# EAGLE design rev1 (EAGLE 6.4)
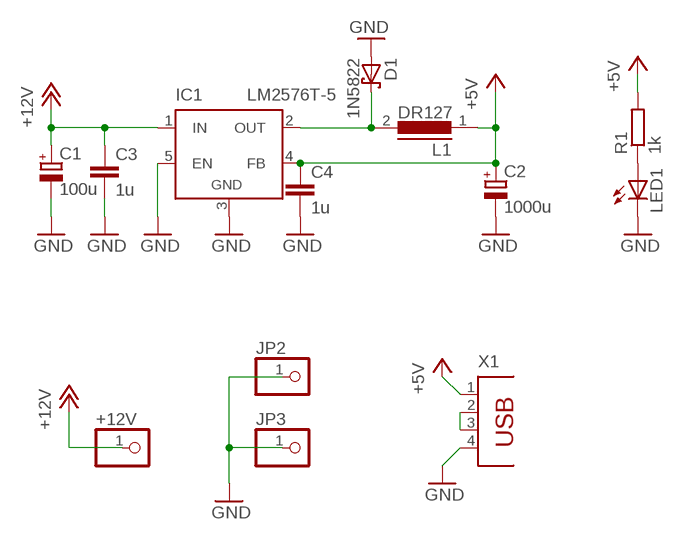
[diagram p0: schematic, sheet 1]

## Parts
+12V  PINHD-1X1  [1X01]
C1  100u  CPOL-EUTT2D6L  [TT2D6L]
C2  1000u  CPOL-EUTT5D9L  [TT5D9L]
C3  1u  C-EUC0805K  [C0805K]
C4  1u  C-EUC0805K  [C0805K]
D1  1N5822  [DO201_5]
IC1  LM2576T-5  LM2596TV  [TO220-51]
JP2  PINHD-1X1  [1X01]
JP3  PINHD-1X1  [1X01]
L1  DR127  [DR127]
LED1  LED3MM  [LED3MM]
R1  1k  R-EU_R0805  [R0805]
X1  PN87520  [PN87520]

## Nets
+5V: C2.+ C4.1 IC1.4(FB) L1.1 R1.2 X1.1
+12V: +12V.1 C1.+ C3.1 IC1.1(IN)
GND: C1.- C2.- C3.2 C4.2 D1.P$2(A) IC1.3(GND) IC1.5(EN) JP2.1 JP3.1 LED1.K(C) X1.4
N$1: LED1.A R1.1
N$2: D1.P$1(C) IC1.2(OUT) L1.2
N$3: X1.2 X1.3

## Library data of the parts
+12V JP2 JP3 = pinhead:PINHD-1X1: PIN HEADER
C1 C2 = rcl:CPOL-EU: POLARIZED CAPACITOR, European symbol
C3 C4 = rcl:C-EU: CAPACITOR, European symbol
D1 = _my_lib:1N5822
IC1 = linear:LM2596T: STEP-DOWN VOLTAGE REGULATOR
L1 = inductors:DR127: High Power Density, High Efficiency, Shielded Inductors Source: coiltronics_dr_series.pdf
LED1 = led:LED: LED OSRAM: - CHIPLED LG R971, LG N971, LY N971, LG Q971, LY Q971, LO R971, LY R971 LH N974, LH R974 LS Q976, LO Q976, LY Q976 LO Q996 - Hyper CHIPLED LW Q18S LB Q993, LB Q99A, LB R99A - SideLED LS A670, LO A670, LY A670, LG A670, LP A670 LB A673, LV A673, LT A673, LW A673 LH A674 LY A675 LS A676, LA A676, LO A676, LY A676, LW A676 LS A679, LY A679, LG A679 - Hyper Micro SIDELED® LS Y876, LA Y876, LO Y876, LY Y876 LT Y87S - SmartLED LW L88C, LW L88S LB L89C, LB L89S, LG L890 LS L89K, LO L89K, LY L89K LS L896, LA L896, LO L896, LY L896 - TOPLED LS T670, LO T670, LY T670, LG T670, LP T670 LSG T670, LSP T670, LSY T670, LOP T670, LYG T670 LG T671, LOG T671, LSG T671 LB T673, LV T673, LT T673, LW T673 LH T674 LS T676, LA T676, LO T676, LY T676, LB T676, LH T676, LSB T676, LW T676 LB T67C, LV T67C, LT T67C, LS T67K, LO T67K, LY T67K, LW E67C LS E67B, LA E67B, LO E67B, LY E67B, LB E67C, LV E67C, LT E67C LW T67C LS T679, LY T679, LG T679 LS T770, LO T770, LY T770, LG T770, LP T770 LB T773, LV T773, LT T773, LW T773 LH T774 LS E675, LA E675, LY E675, LS T675 LS T776, LA T776, LO T776, LY T776, LB T776 LHGB T686 LT T68C, LB T68C - Hyper Mini TOPLED® LB M676 - Mini TOPLED Santana® LG M470 LS M47K, LO M47K, LY M47K Source: http://www.osram.convergy.de LUXEON: - LUMILED® LXK2-PW12-R00, LXK2-PW12-S00, LXK2-PW14-U00, LXK2-PW14-V00 LXK2-PM12-R00, LXK2-PM12-S00, LXK2-PM14-U00 LXK2-PE12-Q00, LXK2-PE12-R00, LXK2-PE12-S00, LXK2-PE14-T00, LXK2-PE14-U00 LXK2-PB12-K00, LXK2-PB12-L00, LXK2-PB12-M00, LXK2-PB14-N00, LXK2-PB14-P00, LXK2-PB14-Q00 LXK2-PR12-L00, LXK2-PR12-M00, LXK2-PR14-Q00, LXK2-PR14-R00 LXK2-PD12-Q00, LXK2-PD12-R00, LXK2-PD12-S00 LXK2-PH12-R00, LXK2-PH12-S00 LXK2-PL12-P00, LXK2-PL12-Q00, LXK2-PL12-R00 Source: www.luxeon.com KINGBRIGHT: KA-3528ASYC Source: www.kingbright.com
R1 = rcl:R-EU_: RESISTOR, European symbol
X1 = con-berg:PN87520: BERG USB connector; OC_FARNELL: unknown; OC_NEWARK: unknown

## Board
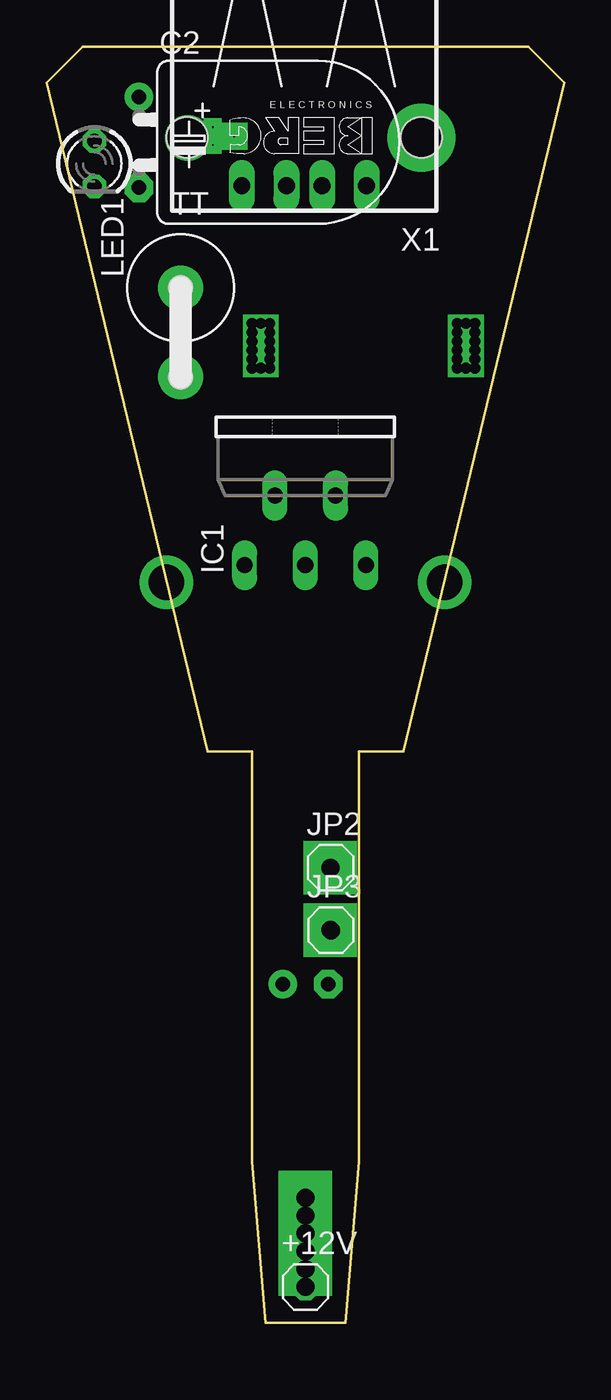
[diagram p1: board, top side]
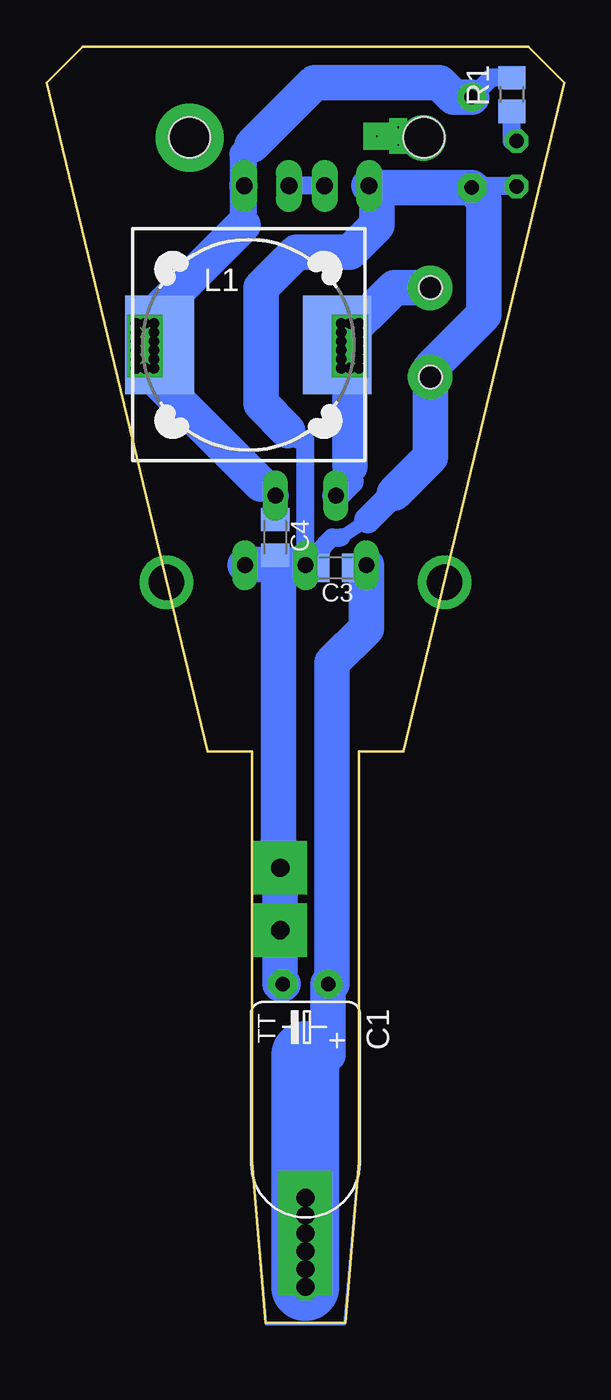
[diagram p2: board, bottom side, seen from below]

Size 29 x 71.5 mm. Coordinates in mm from the lower left corner, seen from the top.
Outline: 9,32 11.5,32 11.5,9 12.25,0 16.75,0 17.5,9 17.5,32 20,32
Outline: 9,32 0,69.5 2,71.5 27,71.5 29,69.5 20,32
Copper layers (1*16): Top 0.035mm / dielectric 1.5mm / Bottom 0.035mm
Design rules "default": minimum track width 10mil, minimum drill 24mil, track to track 8mil, track to pad 8mil, pad to pad 8mil, via to via 8mil, smd to smd 8mil, copper to edge 40mil, drill to drill 8mil, minimum pad ring 10mil, minimum via ring 8mil, stop-mask expansion 4mil, vias tented up to drill 0mil, thermal gap 10mil

### Footprints (pad centres in the part's own frame; a part is rotated, then mirrored left to right if it is on the bottom)
1X01 = drill 1.016 octagon: 1 0,0
TT2D6L = drill 0.813 pad 1.6: + -1.27,0 | drill 0.813 pad 1.6 octagon: - 1.27,0
TT5D9L = drill 0.813 pad 1.6: + -2.54,0 | drill 0.813 pad 1.6 octagon: - 2.54,0
C0805K = smd 1.3 x 1.6: 1 -1,0; 2 1,0
DO201_5 = drill 1.3 pad 2.5: P$1 0,0; P$2 5,0 | hole 1.3: 0,0; 5,0
TO220-51 = drill 0.9 long: 1 -3.4,-8.4; 2 -1.7,-4.5; 3 0,-8.4; 4 1.7,-4.5; 5 3.4,-8.4
DR127 = smd 3.85 x 5.5: 1 -4.975,0; 2 4.975,0
LED3MM = drill 0.813 octagon: A -1.27,0; K 1.27,0
R0805 = smd 1.3 x 1.5: 1 -0.95,0; 2 0.95,0
PN87520 = drill 0.95 long: 1 -3.5,2.71; 2 -1,2.71; 3 1,2.71; 4 3.5,2.71 | hole 2.3: -6.57,0; 6.57,0

### Placement (x,y rotation side)
+12V  14.5,2 0 top
C1  14.5,18.98 180 bottom
C2  5.17,66.15 270 top
C3  12.8,42.3 180 bottom
C4  16.2,44 270 bottom
D1  7.5,58 270 top
IC1  14.49,50.85 0 top
JP2  15.91,25.49 0 top
JP3  15.93,21.99 0 top
L1  17.7,54.8 0 bottom
LED1  2.66,64.96 270 top
R1  2.93,68.83 90 bottom
X1  14.43,66.42 180 top

### Tracks (layer width: path | path; a pad name or v marks a point on that pad's centre or on a via)
+5V
  Bottom 1: R1.2 4.08,69.78 C2.+ | C4.1 IC1.4
  Bottom 1.5: 17.5,66 18,65.5 18,63.78 X1.1 18,63.64 18,61.5 | IC1.4 16.84,47 17,47
  Bottom 2: C2.+ 6.19,68.69 7,69.5 14,69.5 17.5,66 | 18,61.5 22.68,56.83 L1.1 22.68,52.68 17,47
+12V  (via drill 1 pad 3)
  Bottom 1: IC1.1 11.24,42.3 C3.1
  Bottom 2: 14.5,15 13.23,15 C1.+ 13,18.98 13,37 11.09,38.91 IC1.1
  Bottom 3.81: +12V.1 v14.5,3 v14.5,4 v14.5,5 v14.5,6 v14.5,7 14.5,15
GND
  Bottom 0.75: 12.5,44 11,45
  Bottom 1: 4.9,63.88 C2.- | 5.01,63.77 C2.- | 16,42.5 16.2,42.7 C4.2 | 12.5,44 13,44 13.8,43.2 C3.2 14.34,42.3 IC1.3 14.5,49.5 15,49.5 15.5,50 | 10.5,63.5 10.72,63.5 X1.4 | LED1.K 5.17,63.69 C2.-
  Bottom 1.5: 11,45 9.5,46.5
  Bottom 2: X1.4 10.83,63.61 C2.- 4.5,62.94 4.5,56.5 7.5,53.5 D1.P$2 7.5,48.5 9.5,46.5 | C1.- 15.93,18.98 JP3.1 15.93,25.49 JP2.1 16,25.49 16,42.5 | 16,42.5 15.95,42.45 IC1.3 | IC1.5 17.84,42.5 16,42.5 | 15.5,50 17,51.5 17,58 15,60 12,60 10.5,61.5 10.5,63.5
N$1
  Bottom 1: LED1.A 2.93,66.23 R1.1
N$2  (via drill 0.6 pad 1)
  Bottom 1.5: IC1.2 12,47.14 12,48
  Bottom 2: 12,48 v12,53.5 12,54.5 12.3,54.8 L1.2 9.53,58 D1.P$1
N$3
  Bottom 1: X1.3 X1.2
N$4  (via drill 2 pad 3)
  other vias: 6.7,41.5
N$5  (via drill 2 pad 3)
  other vias: 22.3,41.5
N$6  (via drill 0.1 pad 1)
  other vias: 9.3,66
N$7  (via drill 1 pad 3)
  other vias: 15.9,22
N$8  (via drill 1 pad 3)
  other vias: 15.9,25.5
N$9  (via drill 0.1 pad 1)
  other vias: 9.3,67
N$10  (via drill 1.5 pad 3.81)
  other vias: 21,66.4
N$11  (via drill 0.1 pad 1.5)
  other vias: 10.5,66.5
N$12  (via drill 0.6 pad 1)
  other vias: 11.5,56
N$13  (via drill 0.6 pad 1)
  other vias: 11.5,55.5
N$14  (via drill 0.6 pad 1)
  other vias: 11.5,55
N$15  (via drill 0.6 pad 1)
  other vias: 11.5,54.5
N$16  (via drill 0.6 pad 1)
  other vias: 11.5,54
N$17  (via drill 0.6 pad 1)
  other vias: 11.5,53.5
N$18  (via drill 0.6 pad 1)
  other vias: 12.5,53.5
N$19  (via drill 0.6 pad 1)
  other vias: 12.5,54
N$20  (via drill 0.6 pad 1)
  other vias: 12.5,54.5
N$21  (via drill 0.6 pad 1)
  other vias: 12.5,55
N$22  (via drill 0.6 pad 1)
  other vias: 12.5,55.5
N$23  (via drill 0.6 pad 1)
  other vias: 12.5,56
N$24  (via drill 0.6 pad 1)
  other vias: 12,56
N$25  (via drill 0.6 pad 1)
  other vias: 24,56
N$26  (via drill 0.6 pad 1)
  other vias: 24,55.5
N$27  (via drill 0.6 pad 1)
  other vias: 24,55
N$28  (via drill 0.6 pad 1)
  other vias: 24,54
N$29  (via drill 0.6 pad 1)
  other vias: 24,54.5
N$30  (via drill 0.6 pad 1)
  other vias: 24,53.5
N$31  (via drill 0.6 pad 1)
  other vias: 23.5,53.5
N$32  (via drill 0.6 pad 1)
  other vias: 23,53.5
N$33  (via drill 0.6 pad 1)
  other vias: 23,54
N$34  (via drill 0.6 pad 1)
  other vias: 23,54.5
N$35  (via drill 0.6 pad 1)
  other vias: 23,55
N$36  (via drill 0.6 pad 1)
  other vias: 23,55.5
N$37  (via drill 0.6 pad 1)
  other vias: 23,56
N$38  (via drill 0.6 pad 1)
  other vias: 23.5,56
N$39  (via drill 1.5 pad 2.54)
  other vias: 7.9,66.4
N$40
  Bottom 0.128: 2,71.5 27,71.5 29,69.5 20,32 17.5,32 17.5,9 16.7,-0.1 12.3,-0.1 11.5,9 11.5,32 9,32 0,69.5 2,71.5